# Altium schematic sheet LB-word-charsBuffer.SchDoc
size A4
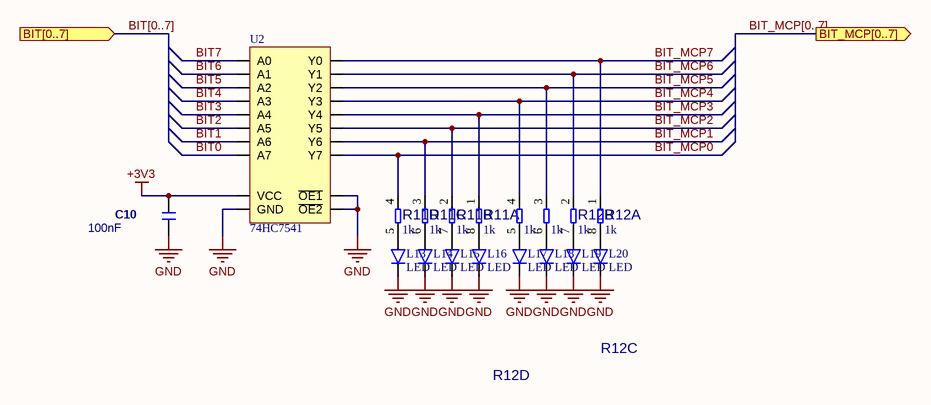
[diagram p0: LB-word-charsBuffer.SchDoc]

## Parts
C10  100nF  [C0603_N]
L13  LED  [LED 0603/1608]
L14  LED  [LED 0603/1608]
L15  LED  [LED 0603/1608]
L16  LED  [LED 0603/1608]
L17  LED  [LED 0603/1608]
L18  LED  [LED 0603/1608]
L19  LED  [LED 0603/1608]
L20  LED  [LED 0603/1608]
R11  value 1k  [YC164]  (parts A,B,C,D of 4)
R12  value 1k  [YC164]  (parts A,B,C,D of 4)
U2  74HC7541  [TSSOP20_N]

## Ports
BIT[0..7] (in), BIT_MCP[0..7] (out)

## Nets
+3V3: C10.1 U2.20(VCC)
GND: C10.2 L13.1(K) L14.1(K) L15.1(K) L16.1(K) L17.1(K) L18.1(K) L19.1(K) L20.1(K) U2.1(~{OE1}) U2.10(GND) U2.19(~{OE2})
BIT0: U2.9(A7)
BIT1: U2.8(A6)
BIT2: U2.7(A5)
BIT3: U2.6(A4)
BIT4: U2.5(A3)
BIT5: U2.4(A2)
BIT6: U2.3(A1)
BIT7: U2.2(A0)
BIT_MCP0: R11.4 U2.11(Y7)
BIT_MCP1: R11.3 U2.12(Y6)
BIT_MCP2: R11.2 U2.13(Y5)
BIT_MCP3: R11.1 U2.14(Y4)
BIT_MCP4: R12.4 U2.15(Y3)
BIT_MCP5: R12.3 U2.16(Y2)
BIT_MCP6: R12.2 U2.17(Y1)
BIT_MCP7: R12.1 U2.18(Y0)
NetL13_2: L13.2(A) R11.5
NetL14_2: L14.2(A) R11.6
NetL15_2: L15.2(A) R11.7
NetL16_2: L16.2(A) R11.8
NetL17_2: L17.2(A) R12.5
NetL18_2: L18.2(A) R12.6
NetL19_2: L19.2(A) R12.7
NetL20_2: L20.2(A) R12.8

## Buses and harness runs
bus BIT[0..7] = port BIT[0..7]
bus BIT_MCP[0..7] = port BIT_MCP[0..7]

## Library data of the parts
C10 = Capacitor: Capacitor MLCC; Manufacturer: Yageo; Manufacturer Part Number: CC0603KRX7R9BB104; Tolerance (%): 10; Category: Capacitor; Package: 0603; Value: 100nF; Supplier Part Number 1: 1362556; Supplier 1: Farnell; ComponentLink1URL: http://www.yageo.com; ComponentLink1Description: Manufacturer Website; Voltage Rating (Volts): *; Supplier 2: Digi-Key; Supplier Part Number 2: 311-1344-1-ND
R11 R12 = Resistor Array - 4P
U2 = 74HC7541: Schmitt Trigger Octal